# EasyEDA Pro project ProDoc_ICM_2025-09-14.epro, board PCB1
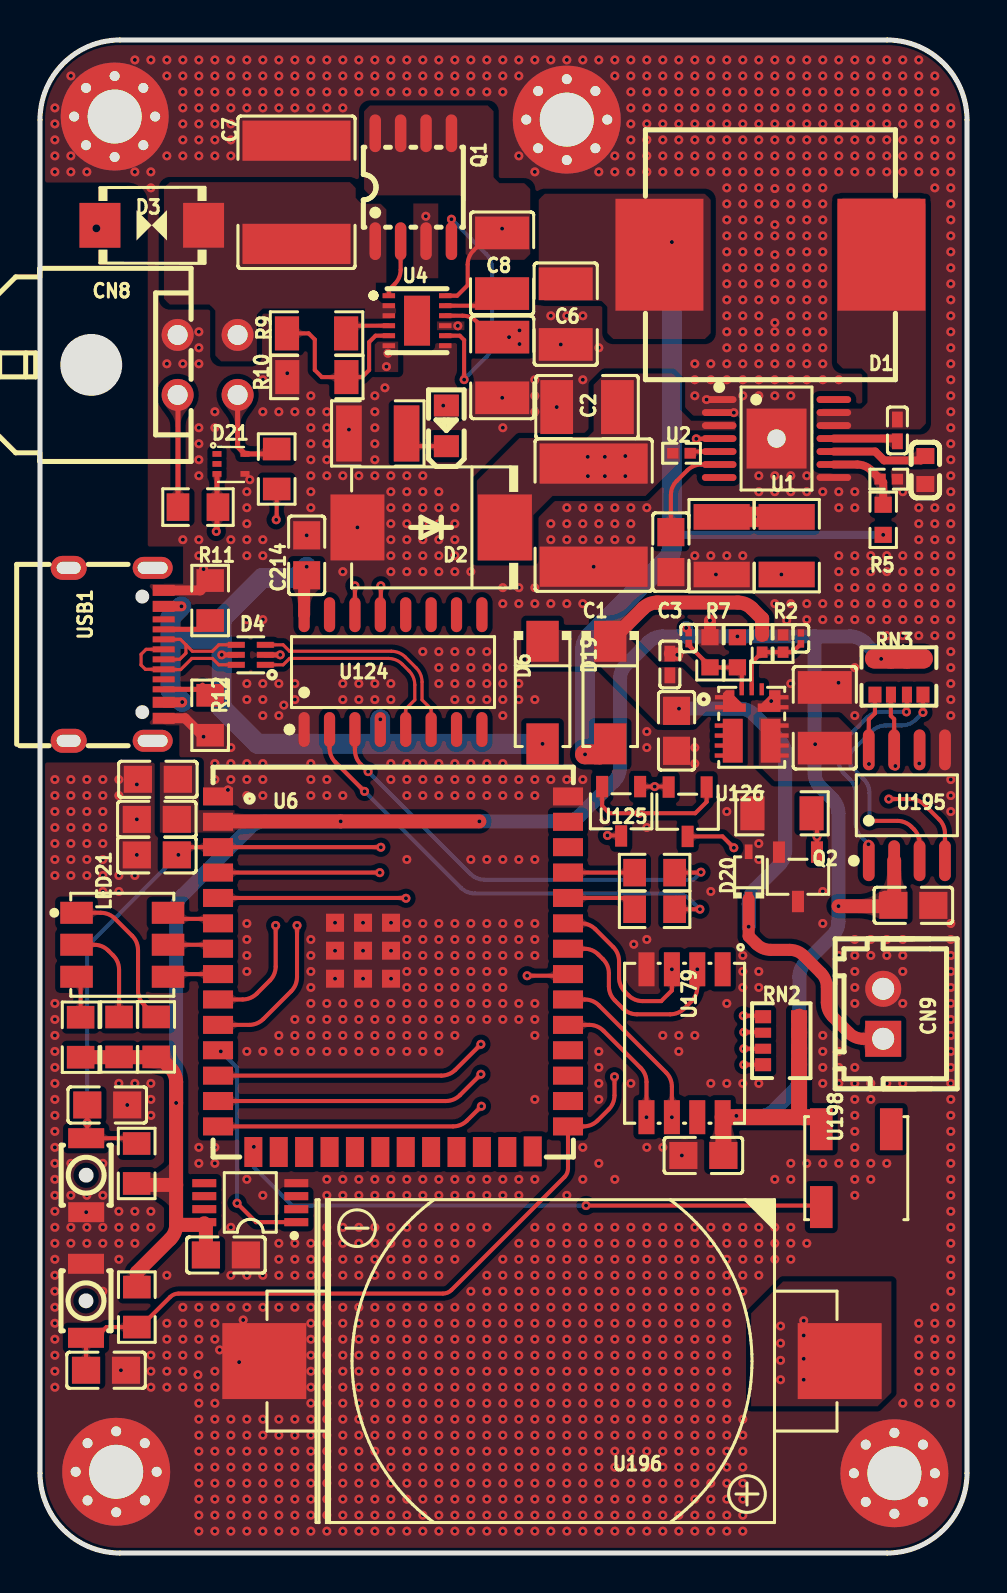
[diagram p1: board, top side]
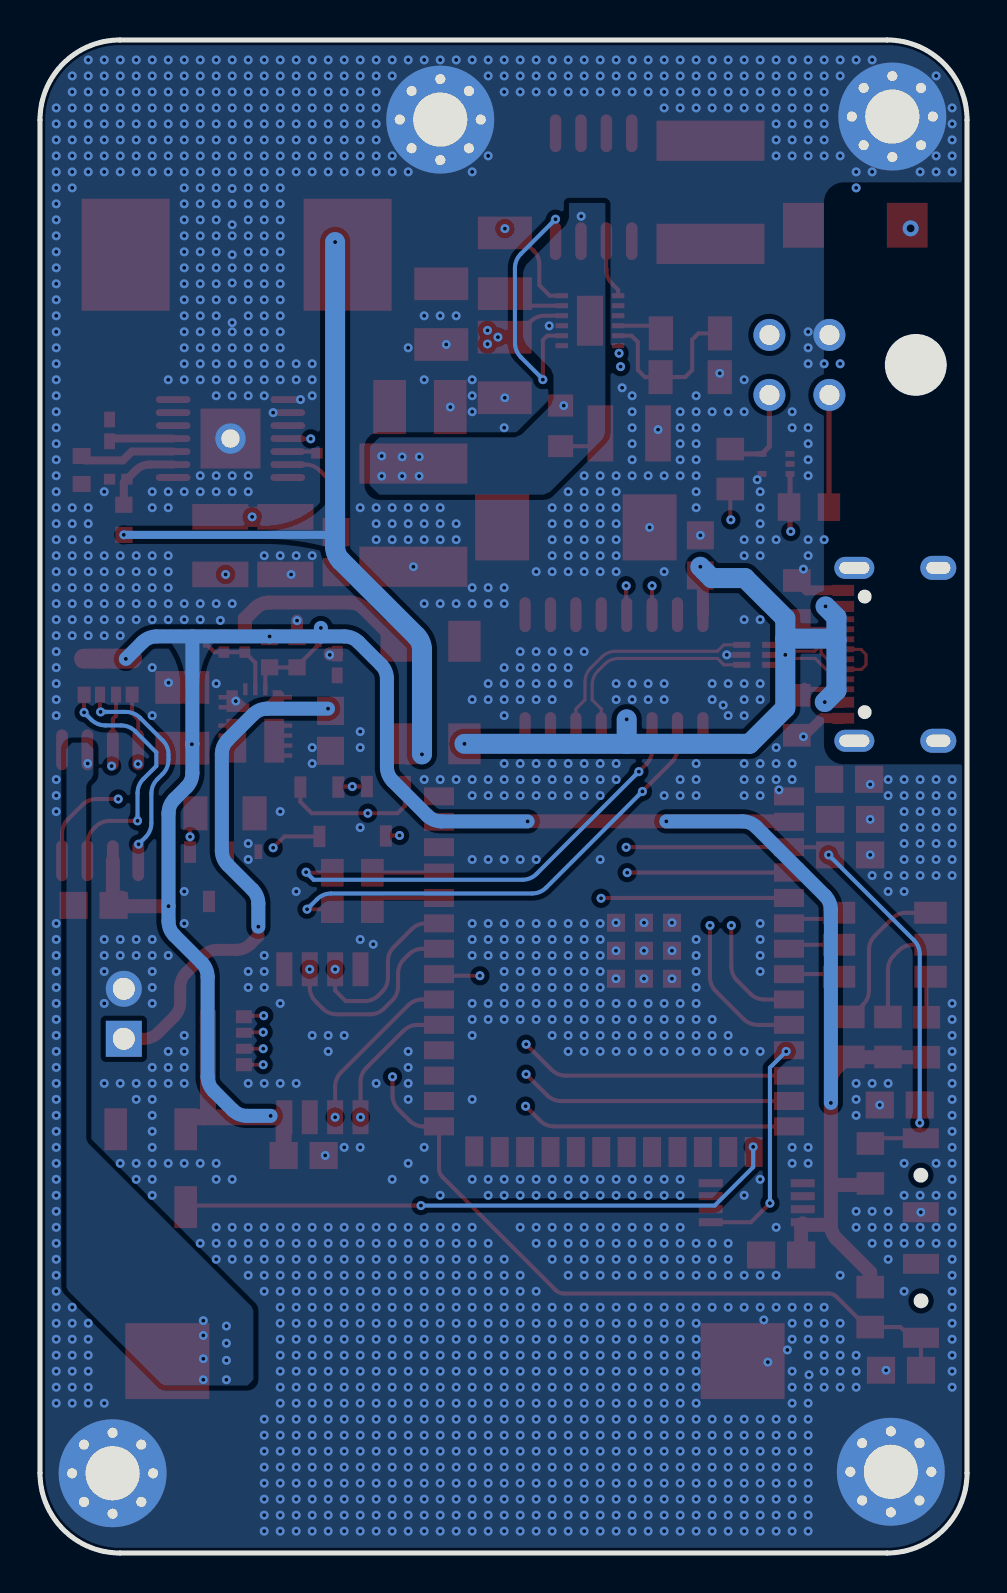
[diagram p2: board, bottom side, seen from below]

Outline 46.35 x 75.69 mm; copper layers: Top Layer, Inner1, Inner2, Bottom Layer. Coordinates in mm from the lower left corner of the outline.
Outline path: 0,71.69 0,4 arc(1.17,1.17) 4,0 42.35,0 arc(45.18,1.17) 46.35,4 46.35,71.69 arc(45.18,74.52) 42.35,75.69 4,75.69 arc(1.17,74.52) 0,71.69
Stack: Top Layer 0.035mm Outer layer thickness 1oz / Dielectric1 0.2104mm 7628 RC49% 8.6mil / Inner1 0.0152mm Inner layer thickness / Dielectric2 1.065mm 1.1mm H/HOZ Copper / Inner2 0.0152mm Inner layer thickness / Dielectric3 0.2104mm 7628 RC49% 8.6mil / Bottom Layer 0.035mm Outer layer thickness 1oz

## Design rules (mm)
net DN: DP2
net DP: DP2
net DPP: DP1
net DNN: DP1
template: Custom Config
spacing copperThickness1oz (default): track to track 0.152, other pairs 0.152 to 0.3
spacing copperThickness2oz: track to track 0.203, other pairs 0.152 to 0.3
track width copperThickness1oz (default): min 0.203, default 0.203, max 2.54
track width copperThickness2oz: min 0.203, default 0.203, max 2.54
differential pair differentialPair (default): width min 0.157, default 0.157, max 0.157; gap min 0.203, default 0.203
via viaSize (default): diameter min 0.4, default 0.45, max 10; hole min 0.2, default 0.2, max 6.3

## Placement (name value [footprint] x y rotation side)
C1  1uF  [C2220]  27.69 51.92 90 top
C2  100nF  [C1210]  27.36 57.33 0 top
C3  22nF  [C0805]  31.55 50.07 90 top
C4  10nF  [C0402]  42.88 56.16 270 top
C5  1uF  [C0603]  44.27 54.18 90 top
C6  100uF  [C1210]  26.29 61.98 90 top
C7  1uF  [C2220]  12.83 68.07 90 top
C8  100nF  [C1210]  23.11 64.52 270 top
C210  100nF  [C0805]  5.89 38.71 0 top
C211  100nF  [C0805]  3.36 22.41 0 top
C212  100nF  [C0805]  3.3 9.14 0 top
C214  100nF  [C0805]  13.33 49.91 90 top
C215  2.2uF  [C0805]  5.84 36.7 0 top
C216  2.2uF  [C0805]  5.84 34.92 0 top
C228  100nF  [C0805]  9.3 14.91 180 top
C270  100nF  [C1210]  23.11 59.31 90 top
C271  100nF  [C0805]  33.17 19.89 0 top
C273  100nF  [C0805]  43.67 32.4 180 top
C275  10uF  [C0805]  31.83 41.13 90 top
C276  100nF  [C0402]  31.5 44.45 270 top
C277  10nF  [C0201]  38.05 45.76 270 top
C278  22pF  [C0201]  32.44 45.77 90 top
C279  47uF  [C1210]  39.24 41.78 270 top
CN8  430450400  [CONN-TH_0430450400]  8.38 59.44 270 top
CN9  ZX-XH2.54-2PZZ  [CONN-TH_2P-P2.50_HX25003-2A]  42.16 26.98 90 top
D1  68uH  [IND-SMD_L12.5-W12.5-SRR1280-150M]  36.53 64.95 180 top
D2  SMCJ58A  [SMC_L6.9-W5.8-LS7.9-RD]  19.56 51.31 180 top
D3  SMBJ58CA  [SMB_L4.6-W3.6-LS5.3-BI]  5.59 66.42 0 top
D4  USBLC6-2P6  [SOT-666-6_L1.6-W1.2-P0.50-LS1.6-BR]  10.54 44.93 0 top
D6  US1M  [SMA_L4.4-W2.8-LS5.4-RD]  25.13 43.05 270 top
D19  US1M  [SMA_L4.4-W2.8-LS5.4-RD]  28.51 43.05 270 top
D20  BAT46WJ,115  [SOD-323F_L2.0-W1.6-LS2.5-RD]  35.44 33.9 90 top
D21  TPD2E2U06DRLR  [SOT-553-5_L1.6-W1.2-P0.50-LS1.6-TL-1]  9.55 54.48 0 top
J1  SCREW-MOUNTING-HOLE-3MM  [MountingHole:MountingHole_2.7mm_M2.5_Pad_Via]  3.81 4.06 90 top
J2  SCREW-MOUNTING-HOLE-3MM  [MountingHole:MountingHole_2.7mm_M2.5_Pad_Via]  42.72 3.99 180 top
J3  SCREW-MOUNTING-HOLE-3MM  [MountingHole:MountingHole_2.7mm_M2.5_Pad_Via]  26.34 71.71 0 top
J4  SCREW-MOUNTING-HOLE-3MM  [MountingHole:MountingHole_2.7mm_M2.5_Pad_Via]  3.73 71.86 0 top
LED21  HL-AF-5060H271BU46FU79GC-S1-THL  [LED-ARRAY-SMD_6P-L5.4-W5.0-TL-FD]  4.11 30.43 0 top
NOREF  -  [Pad_e404]  36.83 55.75 0 top
Q1  FDS3992  [SO-8_L4.9-W3.9-P1.27-LS5.9-BL]  18.67 68.33 0 top
Q2  AO3400A  [SOT-23-3_L2.9-W1.6-P1.90-LS2.8-BR]  37.9 33.83 90 top
R2  75kΩ  [R1210]  37.34 50.39 270 top
R5  3kΩ  [R0603]  42.16 51.69 270 top
R6  2kΩ  [R0402]  42.44 53.72 180 top
R7  2.8kΩ  [R1210]  34.09 50.39 90 top
R9  105kΩ  [R1206]  13.83 61.01 0 top
R10  2.21kΩ  [R1206]  13.84 58.83 0 top
R11  5.1kΩ  [R0805]  8.51 47.65 270 top
R12  5.1kΩ  [R0805]  8.51 41.91 90 top
R200  68kΩ  [R1206]  37.1 37 180 top
R201  10kΩ  [R0805]  4.84 12.3 270 top
R202  10kΩ  [R0805]  4.83 19.49 90 top
R209  0Ω  [R0805]  30.73 32.21 180 top
R248  0Ω  [R0805]  30.73 34.04 180 top
R249  300Ω  [R0805]  2.03 25.8 270 top
R250  300Ω  [R0805]  3.95 25.82 270 top
R251  300Ω  [R0805]  5.81 25.82 270 top
R253  22kΩ  [R1210]  16.89 56.01 0 top
R254  33Ω  [R0805]  7.9 52.32 180 top
R255  33Ω  [R0805]  11.84 54.23 90 top
R256  22.1kΩ  [R0402]  36.11 45.5 90 top
R257  10kΩ  [R0402]  37.16 45.5 270 top
R258  30kΩ  [R0603]  33.5 45.06 270 top
R259  135kΩ  [R0603]  34.87 45.06 90 top
RN2  10kΩ  [RES-ARRAY-SMD_0603-8P-L3.2-W1.6-BL]  37.06 25.63 270 top
RN3  10kΩ  [RES-ARRAY-SMD_0603-8P-L3.2-W1.6-BL]  42.95 43.84 0 top
U1  LM5161PWPR  [HTSSOP-14_L5.0-W4.4-P0.65-LS6.4-BL-EP3.0]  36.83 55.75 270 top
U2  261kΩ  [R0402]  32.08 55.02 180 top
U4  LM74800QDRRRQ1  [WSON-12_L3.0-W3.0-P0.50-TL-EP-2]  18.85 61.65 0 top
U6  ESP32-S3-WROOM-1U-N8R8  [WIRELM-SMD_ESP32-S3-WROOM-1U]  17.65 28.96 0 top
U97  TD-1183SN-1.7H-250  [KEY-SMD_L3.0-W2.5-LS4.0]  2.3 12.62 90 top
U98  TD-1183SN-1.7H-250  [KEY-SMD_L3.0-W2.5-LS4.0]  2.31 18.9 270 top
U124  CH340C  [SOP-16_L10.0-W3.9-P1.27-LS6.0-BL]  17.65 44.07 0 top
U125  BSS138  [SOT-23-3_L2.9-W1.6-P1.90-LS2.8-BR]  29.06 37.11 90 top
U126  BSS138  [SOT-23-3_L2.9-W1.6-P1.90-LS2.8-BR]  32.38 37.08 90 top
U145  DS18B20U-MS  [MSOP-8_L3.0-W3.0-P0.65-LS4.9-BL-1]  10.52 17.53 90 top
U179  MKDV8GIL-AST  [LGA-8_L6.0-W8.0-P1.27-TL]  32.23 25.5 270 top
U194  APT2012LZGCK  [LED-SMD_L2.0-W1.3-R-RD]  20.32 56.39 90 top
U195  DS3231MZ+TRL  [SOIC-8_L4.9-W3.9-P1.27-LS6.0-BL]  43.35 37.41 0 top
U196  CR2032-BS-6  [BAT-TH_CR2032-BS-6-1]  25.6 9.6 0 top
U197  TPSM863252RDXR  [QFN-7_L4.0-W3.3_TPSM863257RDXR]  35.59 41.92 0 top
U198  4kHz  [BUZ-SMD_3P_L5.0-W5.0-P3.50-TL]  40.82 19.25 270 top
USB1  TYPE-C 16PIN 2MD(073)  [USB-C-SMD_TYPE-C-6PIN-2MD-073]  3.81 44.96 270 top

## Footprints (pads in the part's own frame, mm; a bottom-side part is the same pattern mirrored in y, then rotated)
BAT-TH_CR2032-BS-6-1
  rect 4.2x3.8 smd: 1(14.385,0) 2(-14.385,0)
BUZ-SMD_3P_L5.0-W5.0-P3.50-TL
  rect 2.1x1.13 smd: 1(-1.948,-1.75) 2(1.948,-1.75) 3(-1.948,1.75)
C0201
  rect 0.368x0.324 smd: 1(-0.275,0) 2(0.275,0)
C0402
  rect 0.79x0.54 smd: 1(-0.545,0) 2(0.545,0)
C0603
  rect 0.8x0.9 smd: 1(-0.7,0) 2(0.7,0)
C0805
  rect 1.41x1.35 smd: 1(-1,0) 2(1,0)
C1210
  rect 1.635x2.7 smd: 1(-1.518,0) 2(1.518,0)
C2220
  rect 2.01x5.4 smd: 1(-2.58,0) 2(2.58,0)
CONN-TH_2P-P2.50_HX25003-2A
  rect 1.8x1.8 hole 1.1: 1(-1.25,0)
  round 1.8 hole 1.1: 2(1.25,0)
CONN-TH_0430450400
  round 1.6 hole 1: 1(1.5,-1.5) 2(-1.5,-1.5) 3(1.5,1.5) 4(-1.5,1.5)
HTSSOP-14_L5.0-W4.4-P0.65-LS6.4-BL-EP3.0
  oval 0.343x1.732 smd: 1(-1.95,-2.866) 2(-1.3,-2.866) 3(-0.65,-2.866) 4(0,-2.866) 5(0.65,-2.866) 6(1.3,-2.866) 7(1.95,-2.866) 8(1.95,2.866) 9(1.3,2.866) 10(0.65,2.866) 11(0,2.866) 12(-0.65,2.866) 13(-1.3,2.866) 14(-1.95,2.866)
  rect 3x3 smd: 15(0,0)
IND-SMD_L12.5-W12.5-SRR1280-150M
  rect 4.4x5.6 smd: 1(-5.55,0) 2(5.55,0)
KEY-SMD_L3.0-W2.5-LS4.0
  rect 1x1.8 smd: 1(-1.85,0) 2(1.85,0)
LED-ARRAY-SMD_6P-L5.4-W5.0-TL-FD
  rect 1.625x1.1 smd: 1(-2.288,1.6) 2(-2.288,0) 3(-2.288,-1.6) 4(2.288,-1.6) 5(2.288,0) 6(2.288,1.6)
LED-SMD_L2.0-W1.3-R-RD
  rect 1.1x1.25 smd: 1(1.016,0) 2(-1.016,0)
LGA-8_L6.0-W8.0-P1.27-TL
  rect 1.7x0.8 smd: 1(-3.7,1.905) 2(-3.7,0.635) 3(-3.7,-0.635) 4(-3.7,-1.905) 5(3.7,-1.905) 6(3.7,-0.635) 7(3.7,0.635) 8(3.7,1.905)
MountingHole:MountingHole_2.7mm_M2.5_Pad_Via
  round 0.8 hole 0.5: 1(-2.025,0) 1(-1.432,1.432) 1(-1.432,-1.432) 1(0,2.025) 1(0,-2.025) 1(1.432,1.432) 1(1.432,-1.432) 1(2.025,0)
  round 5.4 hole 2.7: 1(0,0)
MSOP-8_L3.0-W3.0-P0.65-LS4.9-BL-1
  rect 0.406x1.2 smd: 1(-0.975,-2.3) 2(-0.325,-2.3) 3(0.325,-2.3) 4(0.975,-2.3) 5(0.975,2.3) 6(0.325,2.3) 7(-0.325,2.3) 8(-0.975,2.3)
Pad_e404
  round 1.524 hole 0.914: 1(0,0)
QFN-7_L4.0-W3.3_TPSM863257RDXR
  custom 1.54x1.08 smd: 1(-0.975,0.697) 4(0.975,0.697)
  custom 1.4x2.195 smd: 2(-1.05,-1.286) 3(1.05,-1.286)
  rect 0.22x0.6 smd: 5(0.5,1.286) 6(0,1.286) 7(-0.5,1.286)
R0402
  rect 0.566x0.54 smd: 1(-0.433,0) 2(0.433,0)
R0603
  rect 0.806x0.864 smd: 1(-0.753,0) 2(0.753,0)
R0805
  rect 1.133x1.377 smd: 1(-1,0) 2(1,0)
R1206
  rect 1.208x1.701 smd: 1(-1.479,0) 2(1.479,0)
R1210
  rect 1.282x2.808 smd: 1(-1.441,0) 2(1.441,0)
RES-ARRAY-SMD_0603-8P-L3.2-W1.6-BL
  rect 0.65x0.8 smd: 1(-1.2,-0.9) 4(1.2,-0.9) 5(1.2,0.9) 8(-1.2,0.9)
  rect 0.5x0.8 smd: 2(-0.4,-0.9) 3(0.4,-0.9) 6(0.4,0.9) 7(-0.4,0.9)
SMA_L4.4-W2.8-LS5.4-RD
  rect 2.046x1.62 smd: 1(-2.566,0) 2(2.566,0)
SMB_L4.6-W3.6-LS5.3-BI
  rect 2.047x2.241 smd: 1(-2.591,0) 2(2.591,0)
SMC_L6.9-W5.8-LS7.9-RD
  rect 2.7x3.3 smd: 1(-3.687,0) 2(3.687,0)
SO-8_L4.9-W3.9-P1.27-LS5.9-BL
  oval 0.574x1.888 smd: 1(-1.905,-2.699) 2(-0.635,-2.699) 3(0.635,-2.699) 4(1.905,-2.699) 5(1.905,2.699) 6(0.635,2.699) 7(-0.635,2.699) 8(-1.905,2.699)
SOD-323F_L2.0-W1.6-LS2.5-RD
  rect 0.73x0.385 smd: 1(-1.185,0) 2(1.185,0)
SOIC-8_L4.9-W3.9-P1.27-LS6.0-BL
  oval 0.588x2.045 smd: 1(-1.905,-2.772) 2(-0.635,-2.772) 3(0.635,-2.772) 4(1.905,-2.772) 5(1.905,2.772) 6(0.635,2.772) 7(-0.635,2.772) 8(-1.905,2.772)
SOP-16_L10.0-W3.9-P1.27-LS6.0-BL
  oval 0.56x1.745 smd: 1(-4.445,-2.873) 2(-3.175,-2.873) 3(-1.905,-2.873) 4(-0.635,-2.873) 5(0.635,-2.873) 6(1.905,-2.873) 7(3.175,-2.873) 8(4.445,-2.873) 9(4.445,2.873) 10(3.175,2.873) 11(1.905,2.873) 12(0.635,2.873) 13(-0.635,2.873) 14(-1.905,2.873) 15(-3.175,2.873) 16(-4.445,2.873)
SOT-23-3_L2.9-W1.6-P1.90-LS2.8-BR
  rect 1.07x0.6 smd: 1(1.235,-0.95) 2(1.235,0.95) 3(-1.235,0)
SOT-553-5_L1.6-W1.2-P0.50-LS1.6-TL-1
  rect 0.45x0.29 smd: 1(-0.7,0.5) 2(-0.7,0) 3(-0.7,-0.5) 4(0.7,-0.5) 5(0.7,0.5)
SOT-666-6_L1.6-W1.2-P0.50-LS1.6-BR
  rect 0.85x0.3 smd: 1(0.725,-0.5) 2(0.725,0) 3(0.725,0.5) 4(-0.725,0.5) 5(-0.725,0) 6(-0.725,-0.5)
USB-C-SMD_TYPE-C-6PIN-2MD-073
  rect 0.55x1.1 smd: 1(-3.2,2.375) 2(-2.4,2.375) 11(2.4,2.375) 12(3.2,2.375)
  rect 0.3x1.1 smd: 3(-1.75,2.375) 4(-1.25,2.375) 5(-0.75,2.375) 6(-0.25,2.375) 7(0.25,2.375) 8(0.75,2.375) 9(1.25,2.375) 10(1.75,2.375)
  oval 1.1x2 hole 0.6x1.5: 13(-4.325,1.825) 14(4.325,1.825)
  oval 1.2x1.8 hole 0.6x1.2: 13(-4.325,-2.375) 14(4.325,-2.375)
WIRELM-SMD_ESP32-S3-WROOM-1U
  rect 1.5x0.9 smd: 1(-8.75,8.895) 2(-8.75,7.625) 3(-8.75,6.355) 4(-8.75,5.085) 5(-8.75,3.815) 6(-8.75,2.545) 7(-8.75,1.275) 8(-8.75,0.005) 9(-8.75,-1.265) 10(-8.75,-2.535) 11(-8.75,-3.805) 12(-8.75,-5.075) 13(-8.75,-6.345) 14(-8.75,-7.615) 27(8.75,-7.615) 28(8.75,-6.345) 29(8.75,-5.075) 30(8.75,-3.805) 31(8.75,-2.535) 32(8.75,-1.265) 33(8.75,0.005) 34(8.75,1.275) 35(8.75,2.545) 36(8.75,3.815) 37(8.75,5.085) 38(8.75,6.355) 39(8.75,7.625) 40(8.75,8.895)
  rect 0.9x1.5 smd: 15(-6.985,-8.895) 16(-5.715,-8.895) 17(-4.445,-8.895) 18(-3.175,-8.895) 19(-1.905,-8.895) 20(-0.635,-8.895) 21(0.635,-8.895) 22(1.905,-8.895) 23(3.175,-8.895) 24(4.445,-8.895) 25(5.715,-8.895) 26(6.985,-8.865)
  rect 0.9x0.9 smd: 41(-2.9,2.575) 41(-2.9,1.175) 41(-2.9,-0.225) 41(-1.5,2.575) 41(-1.5,1.175) 41(-1.5,-0.225) 41(-0.1,2.575) 41(-0.1,1.175) 41(-0.1,-0.225)
WSON-12_L3.0-W3.0-P0.50-TL-EP-2
  rect 0.623x0.25 smd: 1(-1.411,1.25) 2(-1.411,0.75) 3(-1.411,0.25) 4(-1.411,-0.25) 5(-1.411,-0.75) 6(-1.411,-1.25) 7(1.411,-1.25) 8(1.411,-0.75) 9(1.411,-0.25) 10(1.411,0.25) 11(1.411,0.75) 12(1.411,1.25)
  rect 1.3x2.5 smd: 13(0,0)

## Nets
As in the schematic, except:
GND: C1.1 C2.1 C3.1 C5.1 C6.1 C7.2 C210.1 C211.2 C212.2 C214.2 C215.1 C216.1 C228.1 C270.1 C271.1 C273.1 C275.1 C276.1 C277.1 C279.1 CN8.2 CN9.2 D2.2 D4.2 D20.2 D21.4 J1.1 J2.1 J3.1 J4.1 NOREF.1 Q2.2 Q2.3 R6.1 R7.1 R10.1 R11.1 R12.1 R200.2 R253.1 R257.1 R258.1 U1.1 U1.2 U1.8 U1.15 U4.7 U6.1 U6.40 U6.41 U97.2 U98.2 U124.1 U145.4 U179.4 U195.5 U196.2 U197.4 USB1.1 USB1.12

Pads without a net: D21 1 2; U1 7 14; U4 13; U6 16 17 18 19 20 21 22 23 24 25 26 28 29 30 38 39; U124 7 8 9 10 11 12 15; U145 2 3 5 6 7; U197 2 5; U198 3; USB1 3 9

## Via types
v1: diameter 0.45, hole 0.2, Top Layer to Bottom Layer, 1835 vias
v2: diameter 0.8, hole 0.4, Top Layer to Bottom Layer, 1 via

## Routing (per net, layer and track width the routed paths; a pad name or vN(x,y) marks a point on that pad's centre or on a via; arc(x,y) is an arc through that point)
+3V3: length 129.9
  Top Layer w0.7: 6.81,18.42 v1(6.81,22.52) 6.81,23.56 arc(6.73,23.95) 6.51,24.27 5.98,24.8 5.79,24.8 ; 6.81,18.42 6.81,16.42 ; 6.81,18.42 4.91,18.42 R202.1 ; v1(39.93,32.36) 42.63,32.36 C273.2 ; R249.2 5.79,24.8 ; 5.79,24.8 R251.2 ; 8.14,16.42 6.81,16.42 ; 8.14,16.42 8.22,16.5 ; 8.14,16.42 8.3,16.42 C228.2 ; 6.81,16.42 arc(6.73,16.03) 6.51,15.71 4.84,14.04 R201.1 ; v1(21.97,36.6) v1(15.04,36.6) 8.92,36.6 U6.2 ; U195.2 42.71,32.79 42.29,32.79
  Top Layer w0.8: 38.16,21.8 39.07,21.8 39.07,20.9 ; 38.16,21.8 34.17,21.8 ; 38.16,21.8 37.96,22 RN2.5 RN2.6 RN2.7 RN2.8 ; 34.17,21.8 U179.8 ; 34.17,21.8 C271.2
  Top Layer w1: RN3.5 RN3.6 RN3.7 RN3.8
  Bottom Layer w0.7: v1(42.06,44.73) 41.23,45.56 arc(40.91,45.78) 40.52,45.85 38.73,45.85 ; 38.73,45.85 38.73,40.49 ; 38.73,45.85 v1(34.87,45.85) 32.31,45.85 ; 38.73,40.49 v1(38.76,40.46) ; 38.73,40.49 38.73,39.02 arc(38.81,38.64) 39.03,38.31 39.64,37.71 arc(39.85,37.38) 39.93,37 v1(39.93,32.36) 39.93,31.61 arc(39.85,31.22) 39.64,30.9 38.27,29.53 arc(38.05,29.2) 37.97,28.82 37.97,23.83 arc(37.9,23.45) 37.68,23.13 36.72,22.16 arc(36.39,21.95) 36.01,21.87 v1(34.82,21.87) ; v1(6.81,22.52) 6.81,32.17 arc(6.88,32.56) 7.1,32.88 10.53,36.31 arc(10.85,36.53) 11.23,36.6 v1(15.04,36.6) ; v1(21.97,36.6) 26.28,36.6 arc(26.66,36.68) 26.99,36.89 28.71,38.62 arc(28.93,38.94) 29.01,39.33 29.01,43.73 arc(29.08,44.11) 29.3,44.44 30.42,45.56 arc(30.75,45.78) 31.13,45.85 32.31,45.85 ; 32.31,45.85 v1(32.31,46.28)
+5V: length 39.2
  Top Layer w1: D19.2 27.99,39.95 v1(27.25,39.95)
  Bottom Layer w0.4: v1(42.16,50.94) 31.83,50.94
  Bottom Layer w1: v1(27.25,39.95) 27.25,45.18 arc(27.33,45.56) 27.55,45.89 31.3,49.64 arc(31.52,49.97) 31.6,50.35 v1(31.6,65.58)
+48V: length 9.8
  Inner2 w0.6: v1(37.07,48.95) 32.44,53.58 arc(32.12,53.8) 31.74,53.87 v1(29.27,53.87)
  vias: v1(19.29,66.87) v1(20.16,57.4) v1(20.89,61.39) v1(27.39,54.84) v1(27.4,53.87) v1(28.25,54.84) v1(28.25,53.87) v1(29.27,54.88)
GND: length 6.9
  Top Layer w0.254: D4.2 v1(12.01,44.93)
  Top Layer w0.5: 6.19,41.76 7.26,41.76 v1(8.18,40.84) ; R11.1 8.02,48.16 6.19,48.16
  Top Layer w0.6: v1(31.87,44.93) 31.87,45 C276.1 ; R258.1 v1(33.5,46.65)
  vias: v1(0.74,72.29) v1(0.74,71.49) v1(0.74,70.69) v1(0.74,69.89) v1(0.74,69.09) v1(0.74,38.69) v1(0.74,37.89) v1(0.74,37.09) v1(0.74,36.29) v1(0.74,35.49) v1(0.74,34.69) v1(0.74,33.89) v1(0.74,27.49) v1(0.74,26.69) v1(0.74,25.89) v1(0.74,25.09) v1(0.74,24.29) v1(0.74,23.49) v1(0.74,22.69) v1(0.74,21.89) v1(0.74,21.09) v1(0.74,20.29) v1(0.74,19.49) v1(0.74,18.69) v1(0.74,17.89) v1(0.74,17.09) v1(0.74,16.29) v1(0.74,15.49) v1(0.74,14.69) v1(0.74,13.89) v1(0.74,13.09) v1(0.74,12.29) v1(0.74,11.49) v1(0.74,10.69) v1(0.74,9.89) v1(0.74,9.09) v1(0.74,8.29) v1(1.54,73.89) v1(1.54,69.89) v1(1.54,69.09) v1(1.54,38.69) v1(1.54,37.89) v1(1.54,37.09) v1(1.54,36.29) v1(1.54,35.49) v1(1.54,34.69) v1(1.54,33.89) v1(1.54,19.49) v1(1.54,17.89) v1(1.54,16.29) v1(1.54,15.49) v1(2.31,17.05) v1(2.34,69.09) v1(2.34,38.69) v1(2.34,37.89) v1(2.34,37.09) v1(2.34,36.29) v1(2.34,35.49) v1(2.34,34.69) v1(2.34,33.89) v1(2.34,17.89) v1(2.34,16.29) v1(2.34,15.49) v1(3.14,38.69) v1(3.14,37.89) v1(3.14,37.09) v1(3.14,36.29) v1(3.14,35.49) v1(3.14,34.69) v1(3.14,33.89) v1(3.14,33.09) v1(3.14,19.49) v1(3.14,17.89) v1(3.14,16.29) v1(3.14,15.49) v1(3.14,13.09) v1(3.94,38.69) v1(3.94,37.89) v1(3.94,33.89) v1(3.94,33.09) v1(3.94,23.49) v1(3.94,17.09) v1(3.94,16.29) v1(3.94,15.49) v1(3.94,14.69) v1(4.05,9.14) v1(4.36,22.41) v1(4.74,74.69) v1(4.74,69.09) v1(4.74,33.89) v1(4.74,23.49) v1(4.74,17.09) v1(4.74,16.29) v1(4.74,15.49) v1(4.84,38.45) v1(4.84,36.7) v1(4.84,34.92) v1(5.54,74.69) v1(5.54,69.09) v1(5.54,68.29) v1(5.54,23.49) v1(5.54,22.69) v1(5.54,21.89) v1(5.54,17.09) v1(5.54,16.29) v1(5.54,9.89) v1(5.54,9.09) v1(5.54,8.29) v1(6.34,74.69) v1(6.34,73.89) v1(6.34,69.89) v1(6.34,59.49) v1(6.34,13.89) v1(6.34,11.49) v1(6.34,10.69) v1(6.34,9.89) v1(6.34,9.09) v1(6.34,8.29) v1(7.14,74.69) v1(7.14,73.89) v1(7.14,73.09) v1(7.14,72.29) v1(7.14,71.49) v1(7.14,70.69) v1(7.14,69.89) v1(7.14,59.49) v1(7.14,50.69) v1(7.14,12.29) v1(7.14,11.49) v1(7.14,10.69) v1(7.14,9.89) v1(7.14,9.09) v1(7.14,8.29) v1(7.9,8.92) v1(7.94,74.69) v1(7.94,73.89) v1(7.94,73.09) v1(7.94,72.29) v1(7.94,71.49) v1(7.94,70.69) v1(7.94,69.89) v1(7.94,61.09) v1(7.94,60.29) v1(7.94,59.49) v1(7.94,56.29) v1(7.94,55.49) v1(7.94,54.69) v1(7.94,53.89) v1(7.94,50.69) v1(7.94,49.89) v1(7.94,20.29) v1(7.94,19.49) v1(7.94,12.29) v1(7.94,11.49) v1(7.94,10.69) v1(7.94,9.89) v1(7.94,8.29) v1(7.94,7.49) v1(7.94,6.69) v1(7.94,5.89) v1(7.94,5.09) v1(7.94,4.29) v1(7.94,3.49) v1(7.94,2.69) v1(7.94,1.89) v1(7.94,1.09) v1(8.18,49.22) v1(8.74,74.69) v1(8.74,73.89) v1(8.74,73.09) v1(8.74,72.29) v1(8.74,71.49) v1(8.74,70.69) v1(8.74,69.89) v1(8.74,57.09) v1(8.74,56.29) v1(8.74,39.49) v1(8.74,38.69) v1(8.74,20.29) v1(8.74,19.49) v1(8.74,12.29) v1(8.74,11.49) v1(8.74,10.69) v1(8.74,9.09) v1(8.74,8.29) v1(8.74,7.49) v1(8.74,6.69) v1(8.74,5.89) v1(8.74,5.09) v1(8.74,4.29) v1(8.74,3.49) v1(8.74,2.69) v1(8.74,1.89) v1(8.74,1.09) v1(8.98,10.16) v1(9.4,38.18) v1(9.54,74.69) v1(9.54,73.89) v1(9.54,73.09) v1(9.54,72.29) v1(9.54,71.49) v1(9.54,70.69) v1(9.54,69.89) v1(9.54,50.69) v1(9.54,40.29) v1(9.54,39.49) v1(9.54,38.69) v1(9.54,16.29) v1(9.54,13.89) v1(9.54,12.29) v1(9.54,6.69) v1(9.54,5.89) v1(9.54,5.09) v1(9.54,4.29) v1(9.54,3.49) v1(9.54,2.69) v1(9.54,1.89) v1(9.54,1.09) v1(9.96,9.55) v1(10.16,11.66) v1(10.34,74.69) v1(10.34,73.89) v1(10.34,73.09) v1(10.34,72.29) v1(10.34,53.09) v1(10.34,52.29) v1(10.34,51.49) v1(10.34,50.69) v1(10.34,49.89) v1(10.34,46.69) v1(10.34,43.49) v1(10.34,42.69) v1(10.34,39.49) v1(10.34,38.69) v1(10.34,37.89) v1(10.34,31.49) v1(10.34,30.69) v1(10.34,29.89) v1(10.34,29.09) v1(10.34,25.09) v1(10.34,18.69) v1(10.34,13.89) v1(10.34,12.29) v1(10.34,6.69) v1(10.34,5.89) v1(10.34,5.09) v1(10.34,4.29) v1(10.34,3.49) v1(10.34,2.69) v1(10.34,1.89) v1(10.34,1.09) v1(10.49,53.7) v1(11.14,74.69) v1(11.14,73.89) v1(11.14,73.09) v1(11.14,72.29) v1(11.14,58.69) v1(11.14,57.09) v1(11.14,50.69) v1(11.14,49.89) v1(11.14,46.69) v1(11.14,43.49) v1(11.14,42.69) v1(11.14,41.89) v1(11.14,39.49) v1(11.14,38.69) v1(11.14,37.89) v1(11.14,25.09) v1(11.14,17.89) v1(11.14,13.89) v1(11.14,12.29) v1(11.14,6.69) v1(11.14,5.89) v1(11.14,5.09) v1(11.14,4.29) v1(11.14,3.49) v1(11.14,2.69) v1(11.14,1.89) v1(11.14,1.09) v1(11.94,74.69) v1(11.94,73.89) v1(11.94,73.09) v1(11.94,72.29) v1(11.94,57.09) v1(11.94,43.49) v1(11.94,41.89) v1(11.94,25.89) v1(11.94,25.09) v1(11.94,15.49) v1(11.94,14.69) v1(11.94,13.89) v1(11.94,12.29) v1(11.94,6.69) v1(11.94,5.89) v1(11.94,5.09) v1(11.94,4.29) v1(11.94,3.49) v1(11.94,2.69) v1(11.94,1.89) v1(11.94,1.09) v1(12.19,42.42) v1(12.36,59.02) v1(12.74,74.69) v1(12.74,73.89) v1(12.74,73.09) v1(12.74,72.29) v1(12.74,57.09) v1(12.74,43.49) v1(12.74,42.69) v1(12.74,26.69) v1(12.74,25.89) v1(12.74,25.09) v1(12.74,15.49) v1(12.74,14.69) v1(12.74,13.89) v1(12.74,12.29) v1(12.74,6.69) v1(12.74,5.89) v1(12.74,5.09) v1(12.74,4.29) v1(12.74,3.49) v1(12.74,2.69) v1(12.74,1.89) v1(12.74,1.09) v1(13.33,50.91) v1(13.54,74.69) v1(13.54,73.89) v1(13.54,73.09) v1(13.54,72.29) v1(13.54,57.89) v1(13.54,57.09) v1(13.54,56.29) v1(13.54,55.49) v1(13.54,54.69) v1(13.54,53.89) v1(13.54,53.09) v1(13.54,52.29) v1(13.54,39.49) v1(13.54,38.69) v1(13.54,37.89) v1(13.54,30.69) v1(13.54,29.89) v1(13.54,29.09) v1(13.54,28.29) v1(13.54,27.49) v1(13.54,26.69) v1(13.54,25.89) v1(13.54,25.09) v1(13.54,15.49) v1(13.54,14.69) v1(13.54,13.89) v1(13.54,12.29) v1(13.54,11.49) v1(13.54,10.69) v1(13.54,9.89) v1(13.54,9.09) v1(13.54,8.29) v1(13.54,7.49) v1(13.54,6.69) v1(13.54,5.89) v1(13.54,5.09) v1(13.54,4.29) v1(13.54,3.49) v1(13.54,2.69) v1(13.54,1.89) v1(13.54,1.09) v1(14.34,74.69) v1(14.34,73.89) v1(14.34,73.09) v1(14.34,72.29) v1(14.34,57.09) v1(14.34,56.29) v1(14.34,55.49) v1(14.34,54.69) v1(14.34,53.89) v1(14.34,38.69) v1(14.34,37.89) v1(14.34,27.49) v1(14.34,26.69) v1(14.34,25.89) v1(14.34,25.09) v1(14.34,18.69) v1(14.34,17.89) v1(14.34,16.29) v1(14.34,15.49) v1(14.34,14.69) v1(14.34,13.89) v1(14.34,12.29) v1(14.34,11.49) v1(14.34,10.69) v1(14.34,9.89) v1(14.34,9.09) v1(14.34,8.29) v1(14.34,7.49) v1(14.34,6.69) v1(14.34,5.89) v1(14.34,5.09) v1(14.34,4.29) v1(14.34,3.49) v1(14.34,2.69) v1(14.34,1.89) v1(14.34,1.09) v1(14.75,31.53) v1(14.75,30.13) v1(14.75,28.73) v1(15.14,74.69) v1(15.14,73.89) v1(15.14,73.09) v1(15.14,72.29) v1(15.14,53.89) v1(15.14,49.09) v1(15.14,43.49) v1(15.14,42.69) v1(15.14,37.89) v1(15.14,27.49) v1(15.14,26.69) v1(15.14,25.89) v1(15.14,25.09) v1(15.14,18.69) v1(15.14,17.89) v1(15.14,16.29) v1(15.14,15.49) v1(15.14,14.69) v1(15.14,13.89) v1(15.14,12.29) v1(15.14,11.49) v1(15.14,10.69) v1(15.14,9.89) v1(15.14,9.09) v1(15.14,8.29) v1(15.14,7.49) v1(15.14,6.69) v1(15.14,5.89) v1(15.14,5.09) v1(15.14,4.29) v1(15.14,3.49) v1(15.14,2.69) v1(15.14,1.89) v1(15.14,1.09) v1(15.45,56.2) v1(15.87,51.31) v1(15.94,74.69) v1(15.94,73.89) v1(15.94,73.09) v1(15.94,53.89) v1(15.94,43.49) v1(15.94,42.69) v1(15.94,27.49) v1(15.94,26.69) v1(15.94,25.89) v1(15.94,25.09) v1(15.94,18.69) v1(15.94,17.89) v1(15.94,16.29) v1(15.94,15.49) v1(15.94,14.69) v1(15.94,13.89) v1(15.94,12.29) v1(15.94,11.49) v1(15.94,10.69) v1(15.94,9.89) v1(15.94,9.09) v1(15.94,8.29) v1(15.94,7.49) v1(15.94,6.69) v1(15.94,5.89) v1(15.94,5.09) v1(15.94,4.29) v1(15.94,3.49) v1(15.94,2.69) v1(15.94,1.89) v1(15.94,1.09) v1(16.15,31.53) v1(16.15,30.13) v1(16.15,28.73) v1(16.74,74.69) v1(16.74,73.89) v1(16.74,73.09) v1(16.74,57.89) v1(16.74,57.09) v1(16.74,56.29) v1(16.74,55.49) v1(16.74,54.69) v1(16.74,53.89) v1(16.74,43.49) v1(16.74,42.69) v1(16.74,27.49) v1(16.74,26.69) v1(16.74,25.89) v1(16.74,25.09) v1(16.74,18.69) v1(16.74,17.89) v1(16.74,16.29) v1(16.74,15.49) v1(16.74,14.69) v1(16.74,13.89) v1(16.74,12.29) v1(16.74,11.49) v1(16.74,10.69) v1(16.74,9.89) v1(16.74,9.09) v1(16.74,8.29) v1(16.74,7.49) v1(16.74,6.69) v1(16.74,5.89) v1(16.74,5.09) v1(16.74,4.29) v1(16.74,3.49) v1(16.74,2.69) v1(16.74,1.89) v1(16.74,1.09) v1(17.25,58.29) v1(17.54,74.69) v1(17.54,73.89) v1(17.54,73.09) v1(17.54,53.89) v1(17.54,53.09) v1(17.54,52.29) v1(17.54,51.49) v1(17.54,50.69) v1(17.54,49.89) v1(17.54,49.09) v1(17.54,43.49) v1(17.54,42.69) v1(17.54,39.49) v1(17.54,38.69) v1(17.55,31.53) v1(17.55,30.13) v1(17.55,28.73) v1(17.54,27.49) v1(17.54,26.69) v1(17.54,25.89) v1(17.54,25.09) v1(17.54,18.69) v1(17.54,17.89) v1(17.54,16.29) v1(17.54,15.49) v1(17.54,14.69) v1(17.54,13.89) v1(17.54,12.29) v1(17.54,11.49) v1(17.54,10.69) v1(17.54,9.89) v1(17.54,9.09) v1(17.54,8.29) v1(17.54,7.49) v1(17.54,6.69) v1(17.54,5.89) v1(17.54,5.09) v1(17.54,4.29) v1(17.54,3.49) v1(17.54,2.69) v1(17.54,1.89) v1(17.54,1.09) v1(18.34,74.69) v1(18.34,73.89) v1(18.34,73.09) v1(18.34,53.89) v1(18.34,53.09) v1(18.34,52.29) v1(18.34,51.49) v1(18.34,50.69) v1(18.34,49.89) v1(18.34,49.09) v1(18.34,39.49) v1(18.34,38.69) v1(18.34,37.89) v1(18.34,34.69) v1(18.34,31.49) v1(18.34,30.69) v1(18.34,29.89) v1(18.34,29.09) v1(18.34,28.29) v1(18.34,27.49) v1(18.34,26.69) v1(18.34,25.89) v1(18.34,25.09) v1(18.34,18.69) v1(18.34,17.89) v1(18.34,16.29) v1(18.34,15.49) v1(18.34,14.69) v1(18.34,13.89) v1(18.34,12.29) v1(18.34,11.49) v1(18.34,10.69) v1(18.34,9.89) v1(18.34,9.09) v1(18.34,8.29) v1(18.34,7.49) v1(18.34,6.69) v1(18.34,5.89) v1(18.34,5.09) v1(18.34,4.29) v1(18.34,3.49) v1(18.34,2.69) v1(18.34,1.89) v1(18.34,1.09) v1(19.14,74.69) v1(19.14,73.89) v1(19.14,73.09) v1(19.14,53.89) v1(19.14,53.09) v1(19.14,52.29) v1(19.14,51.49) v1(19.14,50.69) v1(19.14,49.89) v1(19.14,49.09) v1(19.14,45.09) v1(19.14,39.49) v1(19.14,38.69) v1(19.14,37.89) v1(19.14,31.49) v1(19.14,30.69) v1(19.14,29.89) v1(19.14,29.09) v1(19.14,28.29) v1(19.14,27.49) v1(19.14,26.69) v1(19.14,25.89) v1(19.14,25.09) v1(19.14,18.69) v1(19.14,17.89) v1(19.14,16.29) v1(19.14,15.49) v1(19.14,14.69) v1(19.14,13.89) v1(19.14,12.29) v1(19.14,11.49) v1(19.14,10.69) v1(19.14,9.89) v1(19.14,9.09) v1(19.14,8.29) v1(19.14,7.49) v1(19.14,6.69) v1(19.14,5.89) v1(19.14,5.09) v1(19.14,4.29) v1(19.14,3.49) v1(19.14,2.69) v1(19.14,1.89) v1(19.14,1.09) v1(19.94,74.69) v1(19.94,73.89) v1(19.94,73.09) v1(19.94,53.09) v1(19.94,52.29) v1(19.94,51.49) v1(19.94,50.69) v1(19.94,49.89) v1(19.94,49.09) v1(19.94,45.09) v1(19.94,44.29) v1(19.94,43.49) v1(19.94,39.49) v1(19.94,38.69) v1(19.94,37.89) v1(19.94,31.49) v1(19.94,30.69) v1(19.94,29.89) v1(19.94,29.09) v1(19.94,28.29) v1(19.94,27.49) v1(19.94,26.69) v1(19.94,25.89) v1(19.94,25.09) v1(19.94,18.69) v1(19.94,17.89) v1(19.94,16.29) v1(19.94,15.49) v1(19.94,14.69) v1(19.94,13.89) v1(19.94,12.29) v1(19.94,11.49) v1(19.94,10.69) v1(19.94,9.89) v1(19.94,9.09) v1(19.94,8.29) v1(19.94,7.49) v1(19.94,6.69) v1(19.94,5.89) v1(19.94,5.09) v1(19.94,4.29) v1(19.94,3.49) v1(19.94,2.69) v1(19.94,1.89) v1(19.94,1.09) v1(20.74,74.69) v1(20.74,73.89) v1(20.74,73.09) v1(20.74,52.29) v1(20.74,51.49) v1(20.74,50.69) v1(20.74,49.89) v1(20.74,49.09) v1(20.74,45.09) v1(20.74,44.29) v1(20.74,43.49) v1(20.74,42.69) v1(20.74,39.49) v1(20.74,38.69) v1(20.74,37.89) v1(20.74,31.49) v1(20.74,30.69) v1(20.74,29.89) v1(20.74,29.09) v1(20.74,28.29) v1(20.74,27.49) v1(20.74,26.69) v1(20.74,25.89) v1(20.74,18.69) v1(20.74,17.89) v1(20.74,16.29) v1(20.74,15.49) v1(20.74,14.69) v1(20.74,12.29) v1(20.74,11.49) v1(20.74,10.69) v1(20.74,9.89) v1(20.74,9.09) v1(20.74,8.29) v1(20.74,7.49) v1(20.74,6.69) v1(20.74,5.89) v1(20.74,5.09) v1(20.74,4.29) v1(20.74,3.49) v1(20.74,2.69) v1(20.74,1.89) v1(20.74,1.09) v1(21.54,74.69) v1(21.54,73.89) v1(21.54,73.09) v1(21.54,49.09) v1(21.54,45.09) v1(21.54,44.29) v1(21.54,43.49) v1(21.54,42.69) v1(21.54,39.49) v1(21.54,38.69) v1(21.54,37.89) v1(21.54,34.69) v1(21.54,31.49) v1(21.54,30.69) v1(21.54,29.89) v1(21.54,29.09) v1(21.54,28.29) v1(21.54,27.49) v1(21.54,26.69) v1(21.54,18.69) v1(21.54,17.89) v1(21.54,16.29) v1(21.54,15.49) v1(21.54,13.09) v1(21.54,12.29) v1(21.54,11.49) v1(21.54,10.69) v1(21.54,9.89) v1(21.54,9.09) v1(21.54,8.29) v1(21.54,7.49) v1(21.54,6.69) v1(21.54,5.89) v1(21.54,5.09) v1(21.54,4.29) v1(21.54,3.49) v1(21.54,2.69) v1(21.54,1.89) v1(21.54,1.09) v1(22.34,74.69) v1(22.34,73.89) v1(22.34,73.09) v1(22.34,45.09) v1(22.34,44.29) v1(22.34,43.49) v1(22.34,42.69) v1(22.34,39.49) v1(22.34,38.69) v1(22.34,37.89) v1(22.34,34.69) v1(22.34,31.49) v1(22.34,30.69) v1(22.34,29.89) v1(22.34,29.09) v1(22.34,28.29) v1(22.34,27.49) v1(22.34,26.69) v1(22.34,18.69) v1(22.34,17.89) v1(22.34,16.29) v1(22.34,13.89) v1(22.34,13.09) v1(22.34,12.29) v1(22.34,11.49) v1(22.34,10.69) v1(22.34,9.89) v1(22.34,9.09) v1(22.34,8.29) v1(22.34,7.49) v1(22.34,6.69) v1(22.34,5.89) v1(22.34,5.09) v1(22.34,4.29) v1(22.34,3.49) v1(22.34,2.69) v1(22.34,1.89) v1(22.34,1.09) v1(23.11,57.79) v1(23.14,74.69) v1(23.14,73.89) v1(23.14,73.09) v1(23.14,56.29) v1(23.14,48.29) v1(23.14,47.49) v1(23.14,44.29) v1(23.14,43.49) v1(23.14,42.69) v1(23.14,41.89) v1(23.14,39.49) v1(23.14,38.69) v1(23.14,37.89) v1(23.14,34.69) v1(23.14,31.49) v1(23.14,30.69) v1(23.14,29.89) v1(23.14,29.09) v1(23.14,28.29) v1(23.14,27.49) v1(23.14,26.69) v1(23.14,18.69) v1(23.14,17.89) v1(23.14,14.69) v1(23.14,13.89) v1(23.14,13.09) v1(23.14,12.29) v1(23.14,11.49) v1(23.14,10.69) v1(23.14,9.89) v1(23.14,9.09) v1(23.14,8.29) v1(23.14,7.49) v1(23.14,6.69) v1(23.14,5.89) v1(23.14,5.09) v1(23.14,4.29) v1(23.14,3.49) v1(23.14,2.69) v1(23.14,1.89) v1(23.14,1.09) v1(23.94,74.69) v1(23.94,73.89) v1(23.94,69.89) v1(23.94,48.29) v1(23.94,47.49) v1(23.94,43.49) v1(23.94,42.69) v1(23.94,38.69) v1(23.94,37.89) v1(23.94,34.69) v1(23.94,31.49) v1(23.94,30.69) v1(23.94,29.89) v1(23.94,27.49) v1(23.94,26.69) v1(23.94,18.69) v1(23.94,17.89) v1(23.94,15.49) v1(23.94,14.69) v1(23.94,13.89) v1(23.94,13.09) v1(23.94,12.29) v1(23.94,11.49) v1(23.94,10.69) v1(23.94,9.89) v1(23.94,9.09) v1(23.94,8.29) v1(23.94,7.49) v1(23.94,6.69) v1(23.94,5.89) v1(23.94,5.09) v1(23.94,4.29) v1(23.94,3.49) v1(23.94,2.69) v1(23.94,1.89) v1(23.94,1.09) v1(24.74,74.69) v1(24.74,69.09) v1(24.74,58.69) v1(24.74,57.89) v1(24.74,57.09) v1(24.74,48.29) v1(24.74,47.49) v1(24.74,42.69) v1(24.74,38.69) v1(24.74,37.89) v1(24.74,34.69) v1(24.74,31.49) v1(24.74,30.69) v1(24.74,29.89) v1(24.74,27.49) v1(24.74,26.69) v1(24.74,25.89) v1(24.74,22.69) v1(24.74,18.69) v1(24.74,16.29) v1(24.74,15.49) v1(24.74,14.69) v1(24.74,13.89) v1(24.74,13.09) v1(24.74,12.29) v1(24.74,11.49) v1(24.74,10.69) v1(24.74,9.89) v1(24.74,9.09) v1(24.74,8.29) v1(24.74,7.49) v1(24.74,6.69) v1(24.74,5.89) v1(24.74,5.09) v1(24.74,4.29) v1(24.74,3.49) v1(24.74,2.69) v1(24.74,1.89) v1(24.74,1.09) v1(25.54,74.69) v1(25.54,61.89) v1(25.54,51.49) v1(25.54,50.69) v1(25.54,47.49) v1(25.54,38.69) v1(25.54,16.29) v1(25.54,15.49) v1(25.54,14.69) v1(25.54,13.89) v1(25.54,13.09) v1(25.54,12.29) v1(25.54,11.49) v1(25.54,10.69) v1(25.54,9.89) v1(25.54,9.09) v1(25.54,8.29) v1(25.54,7.49) v1(25.54,6.69) v1(25.54,5.89) v1(25.54,5.09) v1(25.54,4.29) v1(25.54,3.49) v1(25.54,2.69) v1(25.54,1.89) v1(25.54,1.09) v1(25.84,57.33) v1(26.04,60.46) v1(26.34,74.69) v1(26.34,61.89) v1(26.34,52.29) v1(26.34,51.49) v1(26.34,50.69) v1(26.34,47.49) v1(26.34,38.69) v1(26.34,17.89) v1(26.34,16.29) v1(26.34,15.49) v1(26.34,14.69) v1(26.34,13.89) v1(26.34,13.09) v1(26.34,12.29) v1(26.34,11.49) v1(26.34,10.69) v1(26.34,9.89) v1(26.34,9.09) v1(26.34,8.29) v1(26.34,7.49) v1(26.34,6.69) v1(26.34,5.89) v1(26.34,5.09) v1(26.34,4.29) v1(26.34,3.49) v1(26.34,2.69) v1(26.34,1.89) v1(26.34,1.09) v1(27.14,74.69) v1(27.14,61.89) v1(27.14,58.69) v1(27.14,52.29) v1(27.14,51.49) v1(27.14,50.69) v1(27.14,47.49) v1(27.14,38.69) v1(27.14,20.29) v1(27.14,18.69) v1(27.14,16.29) v1(27.14,15.49) v1(27.14,14.69) v1(27.14,13.89) v1(27.14,13.09) v1(27.14,12.29) v1(27.14,11.49) v1(27.14,10.69) v1(27.14,9.89) v1(27.14,9.09) v1(27.14,8.29) v1(27.14,7.49) v1(27.14,6.69) v1(27.14,5.89) v1(27.14,5.09) v1(27.14,4.29) v1(27.14,3.49) v1(27.14,2.69) v1(27.14,1.89) v1(27.14,1.09) v1(27.69,49.34) v1(27.94,74.69) v1(27.94,69.09) v1(27.94,60.29) v1(27.94,52.29) v1(27.94,51.49) v1(27.94,50.69) v1(27.94,25.09) v1(27.94,24.29) v1(27.94,23.49) v1(27.94,22.69) v1(27.94,19.49) v1(27.94,16.29) v1(27.94,15.49) v1(27.94,14.69) v1(27.94,13.89) v1(27.94,13.09) v1(27.94,12.29) v1(27.94,11.49) v1(27.94,10.69) v1(27.94,9.89) v1(27.94,9.09) v1(27.94,8.29) v1(27.94,7.49) v1(27.94,6.69) v1(27.94,5.89) v1(27.94,5.09) v1(27.94,4.29) v1(27.94,3.49) v1(27.94,2.69) v1(27.94,1.89) v1(27.94,1.09) v1(28.74,74.69) v1(28.74,73.89) v1(28.74,69.89) v1(28.74,69.09) v1(28.74,52.29) v1(28.74,51.49) v1(28.74,50.69) v1(28.74,18.69) v1(28.74,16.29) v1(28.74,15.49) v1(28.74,14.69) v1(28.74,13.89) v1(28.74,13.09) v1(28.74,12.29) v1(28.74,11.49) v1(28.74,10.69) v1(28.74,9.89) v1(28.74,9.09) v1(28.74,8.29) v1(28.74,7.49) v1(28.74,6.69) v1(28.74,5.89) v1(28.74,5.09) v1(28.74,4.29) v1(28.74,3.49) v1(28.74,2.69) v1(28.74,1.89) v1(28.74,1.09) v1(29.54,74.69) v1(29.54,73.89) v1(29.54,73.09) v1(29.54,72.29) v1(29.54,71.49) v1(29.54,70.69) v1(29.54,69.89) v1(29.54,69.09) v1(29.54,52.29) v1(29.54,51.49) v1(29.54,50.69) v1(29.54,23.49) v1(29.54,16.29) v1(29.54,15.49) v1(29.54,14.69) v1(29.54,13.89) v1(29.54,13.09) v1(29.54,12.29) v1(29.54,11.49) v1(29.54,10.69) v1(29.54,9.89) v1(29.54,9.09) v1(29.54,8.29) v1(29.54,7.49) v1(29.54,6.69) v1(29.54,5.89) v1(29.54,5.09) v1(29.54,4.29) v1(29.54,3.49) v1(29.54,2.69) v1(29.54,1.89) v1(29.54,1.09) v1(29.69,30.45) v1(30.34,74.69) v1(30.34,73.89) v1(30.34,73.09) v1(30.34,72.29) v1(30.34,71.49) v1(30.34,70.69) v1(30.34,69.89) v1(30.34,69.09) v1(30.34,52.29) v1(30.34,41.09) v1(30.34,40.29) v1(30.34,36.29) v1(30.34,30.69) v1(30.34,20.29) v1(30.34,16.29) v1(30.34,15.49) v1(30.34,14.69) v1(30.34,13.89) v1(30.34,13.09) v1(30.34,12.29) v1(30.34,11.49) v1(30.34,10.69) v1(30.34,9.89) v1(30.34,9.09) v1(30.34,8.29) v1(30.34,7.49) v1(30.34,6.69) v1(30.34,5.89) v1(30.34,5.09) v1(30.34,4.29) v1(30.34,3.49) v1(30.34,2.69) v1(30.34,1.89) v1(30.34,1.09) v1(31.14,74.69) v1(31.14,73.89) v1(31.14,73.09) v1(31.14,72.29) v1(31.14,71.49) v1(31.14,70.69) v1(31.14,69.89) v1(31.14,69.09) v1(31.14,25.89) v1(31.14,20.29) v1(31.14,16.29) v1(31.14,15.49) v1(31.14,14.69) v1(31.14,13.89) v1(31.14,13.09) v1(31.14,12.29) v1(31.14,11.49) v1(31.14,10.69) v1(31.14,9.89) v1(31.14,9.09) v1(31.14,8.29) v1(31.14,7.49) v1(31.14,6.69) v1(31.14,5.89) v1(31.14,5.09) v1(31.14,4.29) v1(31.14,3.49) v1(31.14,2.69) v1(31.14,1.89) v1(31.14,1.09) v1(31.94,74.69) v1(31.94,73.89) v1(31.94,73.09) v1(31.94,72.29) v1(31.94,71.49) v1(31.94,70.69) v1(31.94,69.89) v1(31.94,69.09) v1(31.94,25.89) v1(31.94,25.09) v1(31.94,16.29) v1(31.94,15.49) v1(31.94,14.69) v1(31.94,13.89) v1(31.94,13.09) v1(31.94,12.29) v1(31.94,11.49) v1(31.94,10.69) v1(31.94,9.89) v1(31.94,9.09) v1(31.94,8.29) v1(31.94,7.49) v1(31.94,6.69) v1(31.94,5.89) v1(31.94,5.09) v1(31.94,4.29) v1(31.94,3.49) v1(31.94,2.69) v1(31.94,1.89) v1(31.94,1.09) v1(32.09,19.89) v1(32.74,74.69) v1(32.74,73.89) v1(32.74,73.09) v1(32.74,72.29) v1(32.74,71.49) v1(32.74,70.69) v1(32.74,69.89) v1(32.74,69.09) v1(32.74,59.49) v1(32.74,58.69) v1(32.74,57.89) v1(32.74,49.89) v1(32.74,40.29) v1(32.74,39.49) v1(32.74,25.89) v1(32.74,16.29) v1(32.74,15.49) v1(32.74,14.69) v1(32.74,13.89) v1(32.74,13.09) v1(32.74,12.29) v1(32.74,11.49) v1(32.74,10.69) v1(32.74,9.89) v1(32.74,9.09) v1(32.74,8.29) v1(32.74,7.49) v1(32.74,6.69) v1(32.74,5.89) v1(32.74,5.09) v1(32.74,4.29) v1(32.74,3.49) v1(32.74,2.69) v1(32.74,1.89) v1(32.74,1.09) v1(33.33,57.7) v1(33.54,74.69) v1(33.54,73.89) v1(33.54,73.09) v1(33.54,72.29) v1(33.54,71.49) v1(33.54,70.69) v1(33.54,69.89) v1(33.54,69.09) v1(33.54,59.49) v1(33.54,58.69) v1(33.54,49.89) v1(33.54,33.09) v1(33.54,23.49) v1(33.54,16.29) v1(33.54,15.49) v1(33.54,14.69) v1(33.54,13.89) v1(33.54,13.09) v1(33.54,12.29) v1(33.54,11.49) v1(33.54,10.69) v1(33.54,9.89) v1(33.54,9.09) v1(33.54,8.29) v1(33.54,7.49) v1(33.54,6.69) v1(33.54,5.89) v1(33.54,5.09) v1(33.54,4.29) v1(33.54,3.49) v1(33.54,2.69) v1(33.54,1.89) v1(33.54,1.09) v1(33.8,48.95) v1(34.34,74.69) v1(34.34,73.89) v1(34.34,73.09) v1(34.34,72.29) v1(34.34,71.49) v1(34.34,70.69) v1(34.34,69.89) v1(34.34,69.09) v1(34.34,68.29) v1(34.34,67.49) v1(34.34,66.69) v1(34.34,65.89) v1(34.34,65.09) v1(34.34,64.29) v1(34.34,63.49) v1(34.34,62.69) v1(34.34,61.89) v1(34.34,61.09) v1(34.34,60.29) v1(34.34,59.49) v1(34.34,58.69) v1(34.34,49.89) v1(34.34,37.09) v1(34.34,27.49) v1(34.34,23.49) v1(34.34,16.29) v1(34.34,15.49) v1(34.34,14.69) v1(34.34,13.89) v1(34.34,13.09) v1(34.34,12.29) v1(34.34,11.49) v1(34.34,10.69) v1(34.34,9.89) v1(34.34,9.09) v1(34.34,8.29) v1(34.34,7.49) v1(34.34,6.69) v1(34.34,5.89) v1(34.34,5.09) v1(34.34,4.29) v1(34.34,3.49) v1(34.34,2.69) v1(34.34,1.89) v1(34.34,1.09) v1(34.7,57.05) v1(35.14,74.69) v1(35.14,73.89) v1(35.14,73.09) v1(35.14,72.29) v1(35.14,71.49) v1(35.14,70.69) v1(35.14,69.89) v1(35.14,69.09) v1(35.14,68.29) v1(35.14,67.49) v1(35.14,66.69) v1(35.14,65.89) v1(35.14,65.09) v1(35.14,64.29) v1(35.14,63.49) v1(35.14,62.69) v1(35.14,61.89) v1(35.14,61.09) v1(35.14,60.29) v1(35.14,59.49) v1(35.14,58.69) v1(35.14,57.89) v1(35.14,49.89) v1(35.14,29.89) v1(35.14,29.09) v1(35.14,28.29) v1(35.14,23.49) v1(35.14,16.29) v1(35.14,15.49) v1(35.14,14.69) v1(35.14,13.89) v1(35.14,13.09) v1(35.14,6.69) v1(35.14,5.89) v1(35.14,5.09) v1(35.14,4.29) v1(35.14,3.49) v1(35.14,2.69) v1(35.14,1.89) v1(35.14,1.09) v1(35.94,74.69) v1(35.94,73.89) v1(35.94,73.09) v1(35.94,72.29) v1(35.94,71.49) v1(35.94,70.69) v1(35.94,69.89) v1(35.94,69.09) v1(35.94,68.29) v1(35.94,67.49) v1(35.94,66.69) v1(35.94,65.89) v1(35.94,65.09) v1(35.94,64.29) v1(35.94,63.49) v1(35.94,62.69) v1(35.94,61.89) v1(35.94,61.09) v1(35.94,60.29) v1(35.94,59.49) v1(35.94,58.69) v1(35.94,57.89) v1(35.94,53.89) v1(35.94,53.09) v1(35.94,35.49) v1(35.94,34.69) v1(35.94,29.09) v1(35.94,28.29) v1(35.94,23.49) v1(35.94,16.29) v1(35.94,15.49) v1(35.94,14.69) v1(35.94,13.89) v1(36.56,42.62) v1(36.74,74.69) v1(36.74,73.89) v1(36.74,73.09) v1(36.74,72.29) v1(36.74,71.49) v1(36.74,70.69) v1(36.74,69.89) v1(36.74,69.09) v1(36.75,68.26) v1(36.74,67.49) v1(36.75,66.45) v1(36.74,65.89) v1(36.75,64.95) v1(36.74,64.29) v1(36.75,63.54) v1(36.74,62.69) v1(36.75,61.55) v1(36.74,61.09) v1(36.74,60.29) v1(36.74,59.49) v1(36.74,58.69) v1(36.74,57.89) v1(36.74,53.89) v1(36.74,53.09) v1(36.74,47.49) v1(36.74,18.69) v1(36.74,16.29) v1(36.74,15.49) v1(36.74,14.69) v1(37.34,46.66) v1(37.54,74.69) v1(37.54,73.89) v1(37.54,73.09) v1(37.54,72.29) v1(37.54,71.49) v1(37.54,70.69) v1(37.54,69.89) v1(37.54,69.09) v1(37.54,68.29) v1(37.54,67.49) v1(37.54,66.69) v1(37.54,65.89) v1(37.54,65.09) v1(37.54,64.29) v1(37.54,63.49) v1(37.54,62.69) v1(37.54,61.89) v1(37.54,61.09) v1(37.54,60.29) v1(37.54,59.49) v1(37.54,58.69) v1(37.54,57.89) v1(37.54,53.89) v1(37.54,53.09) v1(37.54,47.49) v1(37.54,43.49) v1(37.54,19.49) v1(37.54,18.69) v1(37.54,16.29) v1(37.54,15.49) v1(37.54,14.69) v1(38.34,74.69) v1(38.34,73.89) v1(38.34,73.09) v1(38.34,72.29) v1(38.34,71.49) v1(38.34,70.69) v1(38.34,69.89) v1(38.34,69.09) v1(38.34,68.29) v1(38.34,67.49) v1(38.34,66.69) v1(38.34,65.89) v1(38.34,65.09) v1(38.34,64.29) v1(38.34,63.49) v1(38.34,62.69) v1(38.34,61.89) v1(38.34,61.09) v1(38.34,60.29) v1(38.34,59.49) v1(38.34,58.69) v1(38.34,53.89) v1(38.34,53.09) v1(38.34,47.49) v1(38.34,46.69) v1(38.34,19.49) v1(38.34,15.49) v1(39.14,74.69) v1(39.14,73.89) v1(39.14,73.09) v1(39.14,72.29) v1(39.14,71.49) v1(39.14,70.69) v1(39.14,69.89) v1(39.14,69.09) v1(39.14,68.29) v1(39.14,67.49) v1(39.14,66.69) v1(39.14,65.89) v1(39.14,65.09) v1(39.14,64.29) v1(39.14,63.49) v1(39.14,62.69) v1(39.14,61.89) v1(39.14,61.09) v1(39.14,60.29) v1(39.14,59.49) v1(39.14,58.69) v1(39.14,53.09) v1(39.14,47.49) v1(39.14,46.69) v1(39.14,33.09) v1(39.14,31.49) v1(39.14,25.89) v1(39.14,25.09) v1(39.14,24.29) v1(39.14,23.49) v1(39.14,19.49) v1(39.94,74.69) v1(39.94,73.89) v1(39.94,73.09) v1(39.94,72.29) v1(39.94,71.49) v1(39.94,70.69) v1(39.94,69.89) v1(39.94,69.09) v1(39.94,58.69) v1(39.94,53.09) v1(39.94,52.29) v1(39.94,49.89) v1(39.94,49.09) v1(39.94,48.29) v1(39.94,47.49) v1(39.94,46.69) v1(39.93,43.54) v1(39.94,29.89) v1(39.94,25.09) v1(39.94,24.29) v1(39.94,23.49) v1(39.94,19.49) v1(40.74,74.69) v1(40.74,73.89) v1(40.74,73.09) v1(40.74,72.29) v1(40.74,71.49) v1(40.74,70.69) v1(40.74,69.89) v1(40.74,69.09) v1(40.74,53.09) v1(40.74,52.29) v1(40.74,49.89) v1(40.74,49.09) v1(40.74,48.29) v1(40.74,47.49) v1(40.74,46.69) v1(40.74,44.29) v1(40.74,41.89) v1(40.74,30.69) v1(40.74,29.89) v1(40.74,29.09) v1(40.74,28.29) v1(40.74,27.49) v1(40.74,24.29) v1(40.74,23.49) v1(40.74,22.69) v1(40.74,21.89) v1(40.74,21.09) v1(40.74,20.29) v1(40.74,19.49) v1(40.74,18.69) v1(40.74,17.89) v1(41.54,74.69) v1(41.54,73.89) v1(41.54,73.09) v1(41.54,72.29) v1(41.54,71.49) v1(41.54,70.69) v1(41.54,69.89) v1(41.54,69.09) v1(41.54,49.89) v1(41.54,49.09) v1(41.54,48.29) v1(41.54,47.49) v1(41.54,46.69) v1(41.54,30.69) v1(41.54,29.89) v1(41.54,23.49) v1(41.54,22.69) v1(41.54,19.49) v1(41.54,18.69) v1(42.34,74.69) v1(42.34,73.89) v1(42.34,73.09) v1(42.34,72.29) v1(42.34,71.49) v1(42.34,70.69) v1(42.34,69.89) v1(42.34,69.09) v1(42.34,49.89) v1(42.34,49.09) v1(42.34,48.29) v1(42.34,47.49) v1(42.34,46.69) v1(42.34,45.89) v1(42.34,30.69) v1(42.34,29.89) v1(42.34,23.49) v1(42.34,19.49) v1(43.14,74.69) v1(43.14,73.89) v1(43.14,73.09) v1(43.14,72.29) v1(43.14,71.49) v1(43.14,70.69) v1(43.14,69.89) v1(43.14,69.09) v1(43.14,53.09) v1(43.14,49.89) v1(43.14,49.09) v1(43.14,48.29) v1(43.14,47.49) v1(43.14,46.69) v1(43.14,45.89) v1(43.14,30.69) v1(43.14,29.89) v1(43.14,29.09) v1(43.14,27.49) v1(43.14,23.49) v1(43.14,7.49) v1(43.94,74.69) v1(43.94,73.89) v1(43.94,73.09) v1(43.94,72.29) v1(43.94,71.49) v1(43.94,70.69) v1(43.94,69.89) v1(43.94,69.09) v1(43.94,52.29) v1(43.94,51.49) v1(43.94,50.69) v1(43.94,49.89) v1(43.94,49.09) v1(43.94,48.29) v1(43.94,47.49) v1(43.94,46.69) v1(43.94,45.89) v1(43.94,11.49) v1(43.94,10.69) v1(43.94,9.89) v1(43.94,9.09) v1(43.94,8.29) v1(43.94,7.49) v1(44.74,73.89) v1(44.74,73.09) v1(44.74,72.29) v1(44.74,71.49) v1(44.74,70.69) v1(44.74,69.89) v1(44.74,69.09) v1(44.74,68.29) v1(44.74,52.29) v1(44.74,51.49) v1(44.74,50.69) v1(44.74,49.89) v1(44.74,49.09) v1(44.74,48.29) v1(44.74,47.49) v1(44.74,46.69) v1(44.74,45.89) v1(44.74,12.29) v1(44.74,11.49) v1(44.74,10.69) v1(44.74,9.89) v1(44.74,9.09) v1(44.74,8.29) v1(44.74,7.49) v1(45.54,72.29) v1(45.54,71.49) v1(45.54,70.69) v1(45.54,69.89) v1(45.54,69.09) v1(45.54,68.29) v1(45.54,67.49) v1(45.54,66.69) v1(45.54,65.89) v1(45.54,65.09) v1(45.54,64.29) v1(45.54,63.49) v1(45.54,62.69) v1(45.54,61.89) v1(45.54,61.09) v1(45.54,60.29) v1(45.54,59.49) v1(45.54,58.69) v1(45.54,57.89) v1(45.54,57.09) v1(45.54,56.29) v1(45.54,55.49) v1(45.54,54.69) v1(45.54,53.89) v1(45.54,53.09) v1(45.54,52.29) v1(45.54,51.49) v1(45.54,50.69) v1(45.54,49.89) v1(45.54,49.09) v1(45.54,48.29) v1(45.54,47.49) v1(45.54,46.69) v1(45.54,45.89) v1(45.54,45.09) v1(45.54,44.29) v1(45.54,43.49) v1(45.54,42.69) v1(45.54,41.89) v1(45.54,38.69) v1(45.54,37.89) v1(45.54,37.09) v1(45.54,31.49) v1(45.54,30.69) v1(45.54,29.89) v1(45.54,29.09) v1(45.54,28.29) v1(45.54,27.49) v1(45.54,26.69) v1(45.54,25.89) v1(45.54,25.09) v1(45.54,24.29) v1(45.54,23.49) v1(45.54,22.69) v1(45.54,21.89) v1(45.54,21.09) v1(45.54,20.29) v1(45.54,19.49) v1(45.54,18.69) v1(45.54,17.89) v1(45.54,17.09) v1(45.54,16.29) v1(45.54,15.49) v1(45.54,14.69) v1(45.54,13.89) v1(45.54,13.09) v1(45.54,12.29) v1(45.54,11.49) v1(45.54,10.69) v1(45.54,9.89) v1(45.54,9.09) v1(45.54,8.29) v1(45.54,7.49)
VBAT:
  vias: v1(37.03,11.35) v1(37.03,10.5) v1(37.03,9.64) v1(37.03,8.67) v1(38.19,11.62) v1(38.19,10.88) v1(38.19,9.72) v1(38.19,8.67) v1(43.97,39.5)
VBUS: length 40.2
  Top Layer w0.254: D4.5 v1(9.09,44.93)
  Top Layer w0.5: 6.19,47.36 v1(7.07,47.36) ; v1(7.11,42.57) 7.1,42.56 6.19,42.56
  Top Layer w0.6: U124.16 13.21,48.78 C214.1
  Bottom Layer w1: v1(7.07,47.36) 6.53,46.81 6.53,45.67 ; 9.09,45.75 6.6,45.75 6.53,45.67 ; 9.09,45.75 9.09,46.75 11.1,48.77 12.77,48.77 v1(13.33,49.34) ; 9.09,45.75 v1(9.09,44.93) 9.09,42.27 10.88,40.48 17.02,40.48 ; v1(7.11,42.57) 6.53,43.15 6.53,45.67 ; 17.02,40.48 v1(25.13,40.48) ; 17.02,40.48 v1(17.02,41.71)
VCC: length 36.6
  Top Layer w0.6: D20.1 v1(35.44,31.33) 35.44,30.86 35.83,30.47 arc(36.15,30.25) 36.53,30.17 37.48,30.17 arc(37.87,30.1) 38.19,29.88 39.05,29.02 arc(39.27,28.7) 39.34,28.31 39.34,27.54 arc(39.42,27.16) 39.64,26.83 40.45,26.02 arc(40.78,25.8) 41.16,25.73 CN9.1
  Top Layer w0.7: R256.2 36.11,46.74 35.6,47.26 arc(35.27,47.47) 34.89,47.55 30.87,47.55 arc(30.48,47.47) 30.16,47.26 D19.1
  Bottom Layer w0.7: v1(31.95,42.24) 34.99,42.24 arc(35.38,42.16) 35.7,41.95 36.97,40.68 arc(37.19,40.35) 37.26,39.97 37.26,35.14 arc(37.19,34.75) 36.97,34.43 35.73,33.19 arc(35.51,32.86) 35.44,32.48 v1(35.44,31.33)
32K: length 60.1
  Top Layer w0.203: v1(22.07,22.35) 21.35,21.63 arc(21.03,21.42) 20.65,21.34 U6.14 ; RN3.3 43.35,42.1 v1(43.33,42.08) ; U195.1 41.44,35.44 v1(41.43,35.46)
  Inner2 w0.203: v1(41.43,35.46) 40.72,35.46 38.88,33.62 arc(38.66,33.29) 38.58,32.91 38.58,22 arc(38.51,21.62) 38.29,21.3 34.79,17.79 arc(34.46,17.58) 34.08,17.5 29.65,17.5 arc(29.27,17.58) 28.94,17.79 24.68,22.06 arc(24.35,22.28) 23.97,22.35 v1(22.07,22.35)
  Bottom Layer w0.203: v1(41.43,35.46) 41.08,35.81 arc(40.86,36.13) 40.79,36.51 40.79,38 arc(40.71,38.38) 40.49,38.7 40.22,38.98 arc(40.01,39.3) 39.93,39.68 39.93,39.95 arc(40,40.33) 40.22,40.65 41.35,41.78 arc(41.68,42) 42.06,42.08 v1(43.33,42.08)
B: length 2.6
  Top Layer w0.203: U6.8 6.74,28.96 6.6,28.83 LED21.4
BOOT: length 52.8
  Top Layer w0.203: v1(34.7,35.28) 34.13,35.85 U126.3 ; v1(28.73,23.83) 28.73,22.89 arc(28.65,22.51) 28.43,22.19 27.88,21.63 arc(27.56,21.42) 27.17,21.34 U6.27 26.4,19.23 arc(26.36,19.01) 26.23,18.81 20.57,13.16 arc(20.38,13.02) 20.15,12.98 6.93,12.98 arc(6.7,12.93) 6.5,12.8 5,11.3 R201.2 3.33,11.3 2.79,10.77 U97.1 ; 2.3,10.77 C212.1
  Inner2 w0.203: v1(28.73,23.83) 28.73,27.07 arc(28.8,27.45) 29.02,27.78 31.25,30.01 arc(31.58,30.23) 31.96,30.3 32.94,30.3 arc(33.32,30.38) 33.64,30.59 34.4,31.36 arc(34.62,31.68) 34.7,32.06 v1(34.7,35.28)
BST: length 3.1
  Top Layer w0.4: U1.11 42.8,55.75
BUZZ: length 30.2
  Top Layer w0.203: 39.07,17.31 38.99,17.38 v1(27.31,17.38)
  Bottom Layer w0.203: v1(27.31,17.38) 12.62,17.38 10.69,19.3 v1(10.69,20.32)
CAP: length 3
  Top Layer w0.203: C8.2 22.79,62.69 arc(22.47,62.48) 22.09,62.4 U4.11
CC1: length 2
  Top Layer w0.254: 6.19,43.21 7.92,43.21 8.13,43.42
CC2: length 2
  Top Layer w0.254: 6.19,46.21 8.02,46.21 8.15,46.34
DGATE: length 2.9
  Top Layer w0.203: Q1.2 18.03,64.19 arc(17.96,63.81) 17.74,63.49 17.44,63.19 U4.1
DN: length 11.3
  Top Layer w0.158: D4.3 12.16,45.43 12.48,45.11 17.57,45.11 arc(17.95,45.04) 18.27,44.82 18.81,44.28 arc(19.03,43.96) 19.1,43.58 19.1,42.68 19.56,42.23 U124.6
DNN: length 5.7
  Top Layer w0.158: 7.3,45.44 7.03,45.71 6.19,45.71 ; 7.3,45.44 7.62,45.11 8.62,45.11 8.94,45.43 D4.4 ; 7.3,45.44 7.3,45.02 6.99,44.71 6.19,44.71
DP: length 10.7
  Top Layer w0.158: D4.1 12.16,44.43 12.48,44.75 17.42,44.75 arc(17.8,44.68) 18.12,44.46 18.45,44.13 arc(18.67,43.81) 18.74,43.43 18.74,42.68 18.29,42.23 U124.5
DPP: length 7
  Top Layer w0.158: D4.6 8.94,44.43 8.62,44.75 7.59,44.75 7.04,44.2 6.2,44.2 6.19,44.21 5.27,44.21 5.05,44.42 5.05,44.96 5.3,45.21 6.19,45.21
DTR: length 21.2
  Top Layer w0.203: v1(17.04,48.39) 17.04,46.97 U124.13 ; U125.1 v1(30.74,38.34) 31.41,38.34 U126.2
  Inner2 w0.203: v1(30.74,38.34) 30.74,39.11 21.76,48.09 arc(21.43,48.31) 21.05,48.39 v1(17.04,48.39)
EARTH: length 8.4
  Inner2 w1: USB1.13 USB1.13 ; USB1.14 USB1.14
  vias: v2(2.82,66.27)
EN: length 42.2
  Top Layer w0.203: R202.2 4.57,20.75 U98.1 2.36,20.81 v1(2.36,21.52) C211.1 ; C216.2 7.23,35.31 U6.3 17.04,35.31 v1(17.04,35.31) ; v1(28.38,35.9) 29.03,35.9 U125.3
  Inner2 w0.203: v1(17.04,35.31) 27.37,35.31 arc(27.75,35.38) 28.08,35.6 v1(28.38,35.9)
  Bottom Layer w0.203: v1(2.36,21.52) 2.36,29.95 arc(2.44,30.34) 2.66,30.66 v1(6.92,34.92)
END: length 4.2
  Top Layer w0.203: C277.2 37.63,45.07 R257.2 R256.1 35.59,44.54 U197.6
FAN: length 48.5
  Top Layer w0.203: R200.1 38.85,36.73 v1(38.85,35.83) Q2.1 ; U6.12 20.06,23.88 arc(20.45,23.96) 20.77,24.17 v1(22.05,25.45)
  Inner2 w0.203: v1(38.85,35.83) 37.38,34.36 arc(37.16,34.03) 37.08,33.65 37.08,22.97 arc(37.01,22.59) 36.79,22.26 34.2,19.67 arc(33.88,19.46) 33.5,19.38 30.61,19.38 arc(30.23,19.46) 29.91,19.67 24.42,25.16 arc(24.1,25.37) 23.72,25.45 v1(22.05,25.45)
FB3: length 4.1
  Top Layer w0.203: U197.7 35.09,44.16 34.95,44.3 33.97,44.3 arc(33.58,44.38) 33.26,44.6 32.51,45.35 32.51,45.48
FB5: length 3.9
  Top Layer w0.4: U1.9 40.86,54.45 arc(41.25,54.38) 41.57,54.16 R6.2 42.16,53.57 R5.1
FLAG: length 11.3
  Top Layer w0.203: v1(9.85,17.5) 10.81,16.55 U145.1
  Bottom Layer w0.203: v1(9.85,17.5) 9.85,24.28 v1(9.04,25.09)
G: length 2.6
  Top Layer w0.203: LED21.5 8.7,30.43 U6.7
HGATE: length 13.5
  Top Layer w0.203: Q1.4 v1(20.57,66.73) ; v1(21.21,58.7) 21.21,60.68 20.99,60.9 U4.8
  Bottom Layer w0.203: v1(21.21,58.7) 21.21,58.73 22.31,59.83 arc(22.53,60.15) 22.61,60.54 22.61,64.28 arc(22.53,64.66) 22.31,64.99 v1(20.57,66.73)
INT: length 62.5
  Top Layer w0.203: U6.13 20.29,22.61 arc(20.67,22.69) 21,22.9 v1(22.05,23.95) ; 43.98,34.63 43.98,35.51 arc(43.91,35.89) 43.69,36.22 43.57,36.33 arc(43.25,36.55) 42.87,36.63 v1(41.48,36.63) ; RN3.4 v1(44.15,42.05)
  Inner2 w0.203: v1(22.05,23.95) 23.77,23.95 arc(24.15,23.88) 24.47,23.66 29.35,18.78 arc(29.67,18.57) 30.06,18.49 33.77,18.49 arc(34.16,18.57) 34.48,18.78 37.5,21.81 arc(37.72,22.13) 37.79,22.51 37.79,33.44 arc(37.87,33.83) 38.09,34.15 40.27,36.33 arc(40.6,36.55) 40.98,36.63 v1(41.48,36.63)
  Bottom Layer w0.203: v1(41.48,36.63) 41.48,38.02 arc(41.4,38.4) 41.19,38.72 40.54,39.37 40.54,40.06 41.59,41.11 arc(41.92,41.33) 42.3,41.4 43.09,41.4 arc(43.47,41.48) 43.79,41.7 v1(44.15,42.05)
LED: length 2.6
  Top Layer w0.203: U194.2 18.33,55.37 R253.2
OV: length 8.6
  Top Layer w0.203: 12.35,61.01 13.43,61.01 13.74,60.71 13.74,59.18 14.1,58.83 R10.2 16.1,58.83 16.46,59.18 16.46,60.58 16.78,60.9 U4.5
PWRXD: length 30.8
  Top Layer w0.203: U6.9 10.13,27.69 arc(10.51,27.77) 10.84,27.98 11.49,28.64 arc(11.71,28.96) 11.79,29.34 v1(11.79,31.39)
  Top Layer w0.254: D21.3 8.85,51.14 v1(8.81,51.11)
  Inner2 w0.203: v1(11.79,31.39) 11.79,40.12 arc(11.86,40.51) 12.08,40.83 13.12,41.87 arc(13.34,42.2) 13.41,42.58 13.41,45.48 arc(13.33,45.87) 13.12,46.19 8.81,50.5 v1(8.81,51.11)
PWTXD: length 30.8
  Top Layer w0.203: U6.10 10.46,26.42 arc(10.84,26.5) 11.17,26.71 12.56,28.1 arc(12.78,28.43) 12.85,28.81 v1(12.85,31.39) ; v1(11.81,51.69) 11.84,51.71 R255.1
  Inner2 w0.203: v1(12.85,31.39) 12.85,39.79 arc(12.93,40.18) 13.15,40.5 13.78,41.13 arc(14,41.46) 14.07,41.84 14.07,46.14 arc(14,46.53) 13.78,46.85 12.1,48.53 arc(11.89,48.85) 11.81,49.23 v1(11.81,51.69)
R: length 2.7
  Top Layer w0.203: U6.6 8.68,31.72 6.71,31.72 LED21.6
RON: length 1.5
  Top Layer w0.203: 32.44,55.12 32.45,55.1 U1.5
RSTRTC: length 30.9
  Top Layer w0.203: v1(24.36,28.88) 26.32,28.88 U6.33 ; U195.4 45.25,35.99 arc(45.18,36.38) 44.96,36.7 44.23,37.43 arc(43.91,37.64) 43.53,37.72 v1(42.44,37.72)
  Inner2 w0.203: v1(42.44,37.72) 36.48,37.72 arc(36.1,37.64) 35.78,37.43 34.38,36.03 arc(34.16,35.71) 34.09,35.32 34.09,32.29 arc(34.01,31.91) 33.79,31.58 33.44,31.23 arc(33.12,31.01) 32.73,30.94 31.83,30.94 arc(31.45,30.86) 31.13,30.64 29.66,29.17 arc(29.33,28.96) 28.95,28.88 v1(24.36,28.88)
RTS: length 28.6
  Top Layer w0.203: U124.14 v1(15.75,48.39) ; U126.1 33.33,37.58 32.77,37.01 v1(29.96,37.01) 28.47,37.01 28.11,37.37 U125.2
  Inner2 w0.203: v1(15.75,48.39) 16.24,47.89 arc(16.57,47.68) 16.95,47.6 20.74,47.6 arc(21.13,47.52) 21.45,47.31 29.67,39.09 arc(29.89,38.76) 29.96,38.38 v1(29.96,37.01)
RXD: length 22.7
  Top Layer w0.203: R248.1 33.03,34.04 v1(33.05,34.06) ; v1(16.41,39.09) 16.04,39.46 arc(15.82,39.78) 15.75,40.17 U124.3
  Bottom Layer w0.203: v1(16.41,39.09) 21.53,33.97 arc(21.85,33.76) 22.23,33.68 32.67,33.68 v1(33.05,34.06)
RXD0EP: length 3.6
  Top Layer w0.203: R209.2 29.17,32.77 U6.36
RXDPW: length 5.6
  Top Layer w0.254: R254.2 6.9,57.92 CN8.1
